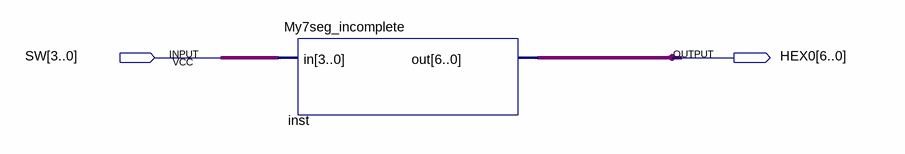
[diagram p0: schematic sheet]
// Quartus schematic 7segdecoder.bdf as structural Verilog: 1 symbols, 2 pins
module \7segdecoder  (
  input  [3:0] SW,
  output [6:0] HEX0
);

  My7seg_incomplete inst (.in(SW), .out(HEX0));
endmodule
